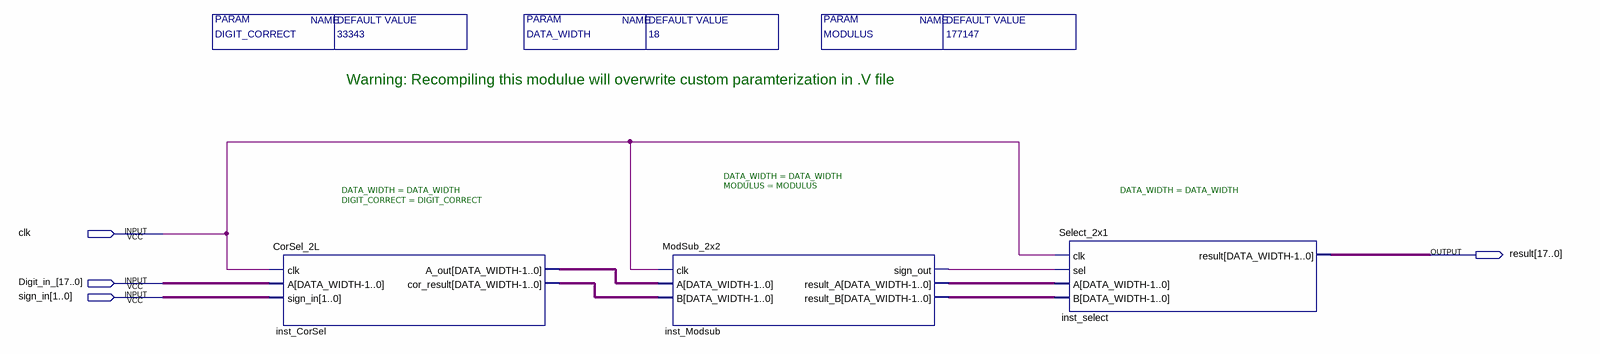
[diagram p0: schematic sheet]
// Quartus schematic SubCor_4L.bdf as structural Verilog: 3 symbols, 4 pins
module SubCor_4L #(parameter DATA_WIDTH = 18, parameter MODULUS = 177147, parameter DIGIT_CORRECT = 33343) (
  input  clk,
  input  [17:0] Digit_in_,
  input  [1:0] sign_in,
  output [17:0] result
);

  wire inst_Modsub_sign_out;
  wire [17:0] inst_CorSel_a_out, inst_CorSel_cor_result, inst_Modsub_result_a, inst_Modsub_result_b;

  CorSel_2L #(.DATA_WIDTH(DATA_WIDTH), .DIGIT_CORRECT(DIGIT_CORRECT)) inst_CorSel (
    .clk(clk), .A(Digit_in_), .sign_in(sign_in), .A_out(inst_CorSel_a_out),
    .cor_result(inst_CorSel_cor_result));
  ModSub_2x2 #(.DATA_WIDTH(DATA_WIDTH), .MODULUS(MODULUS)) inst_Modsub (
    .clk(clk), .A(inst_CorSel_a_out), .B(inst_CorSel_cor_result), .sign_out(inst_Modsub_sign_out),
    .result_A(inst_Modsub_result_a), .result_B(inst_Modsub_result_b));
  Select_2x1 #(.DATA_WIDTH(DATA_WIDTH)) inst_select (
    .clk(clk), .sel(inst_Modsub_sign_out), .A(inst_Modsub_result_a), .B(inst_Modsub_result_b), .result(result));

  // Notes on the sheet:
  //   Warning: Recompiling this modulue will overwrite custom paramterization in .V file
endmodule
